# Altium schematic sheet MCU.SchDoc
size A2
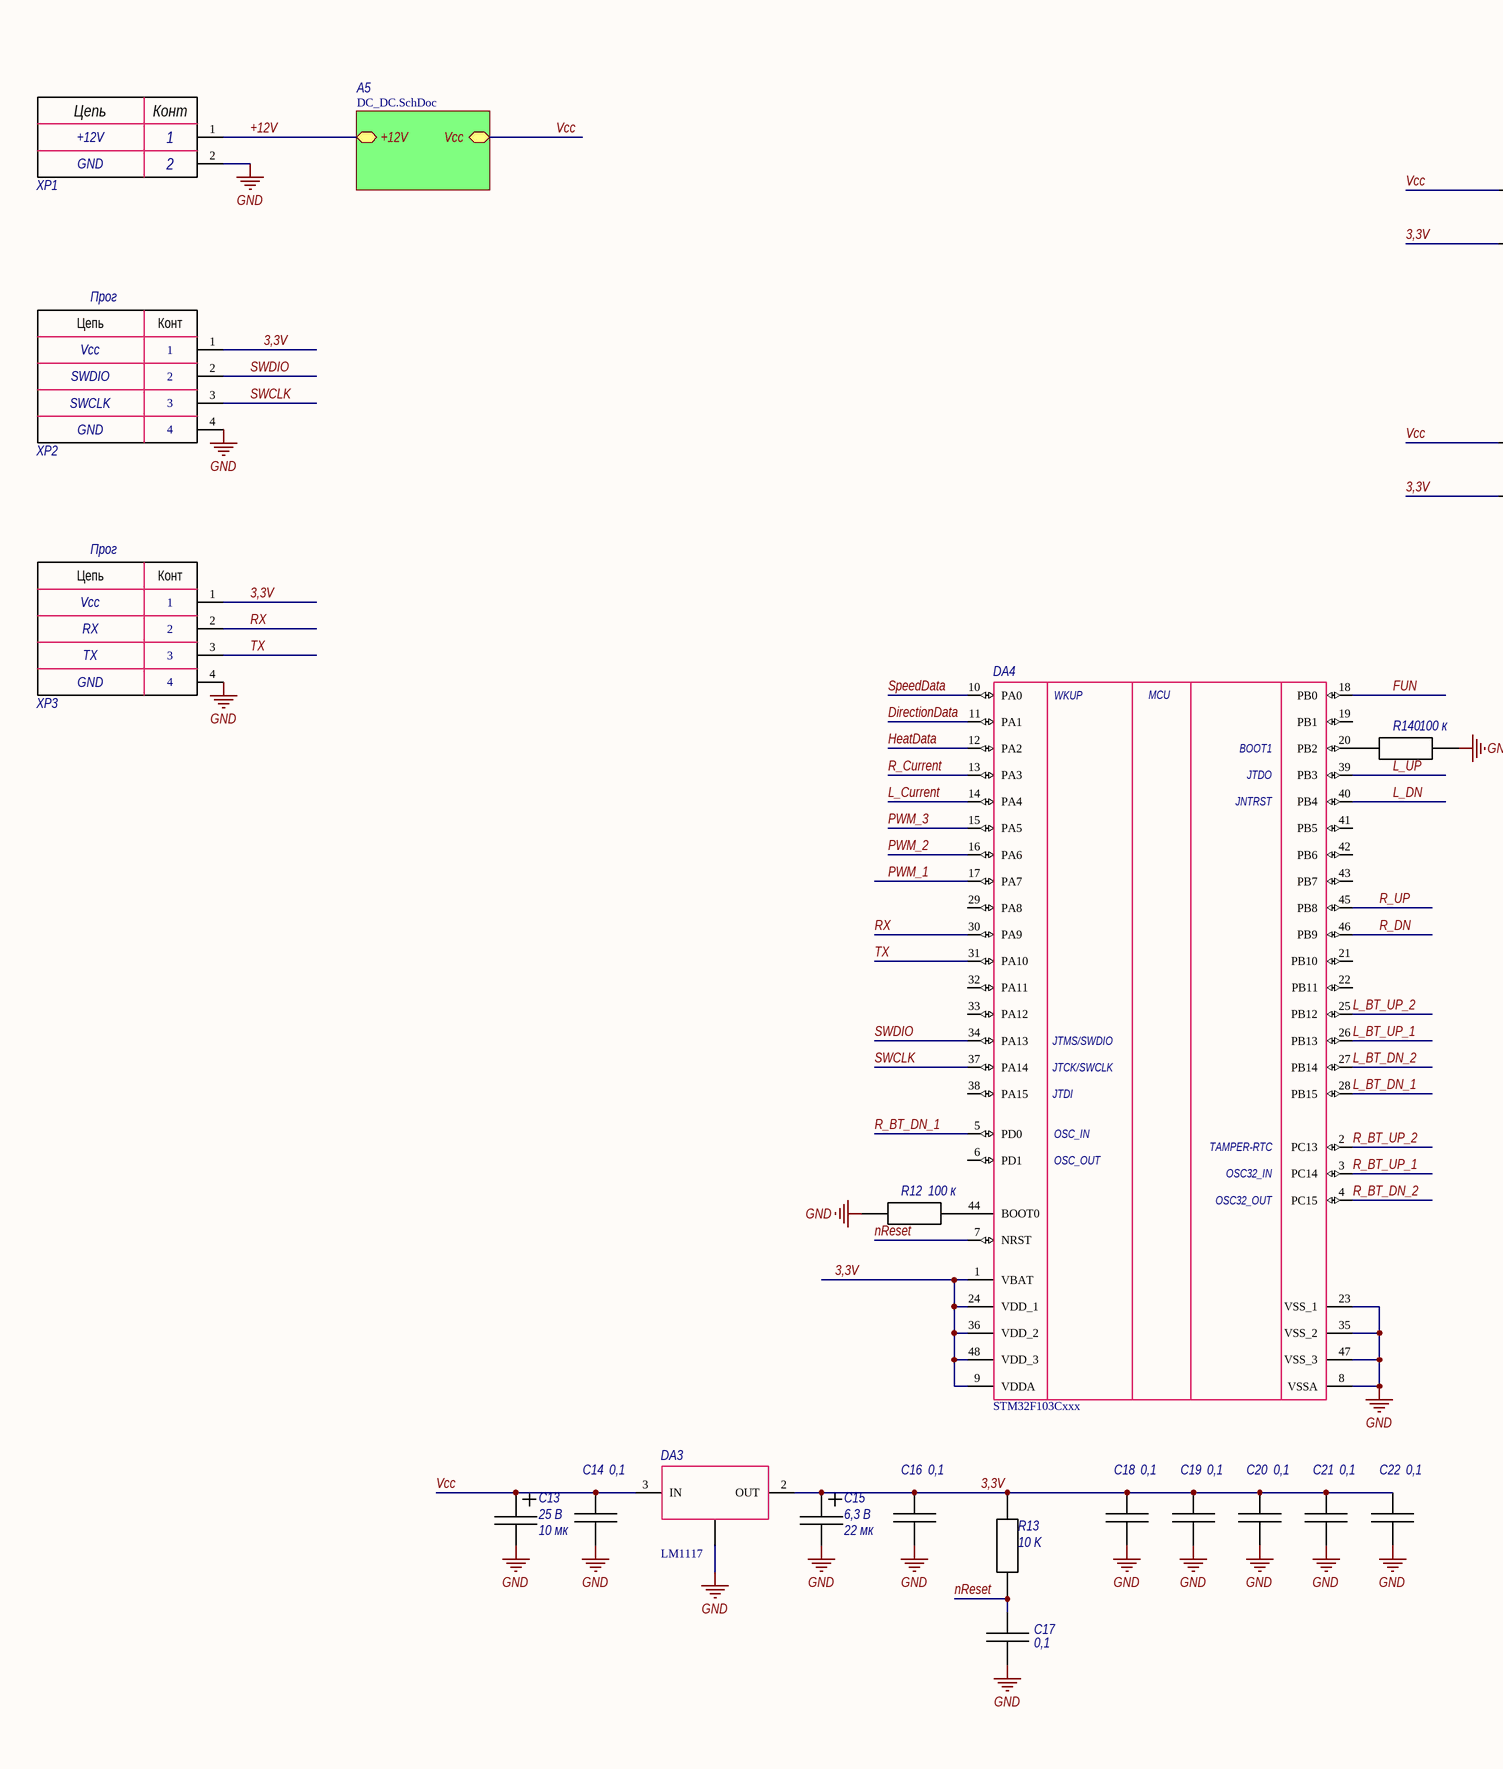
[diagram p0: MCU.SchDoc, left]
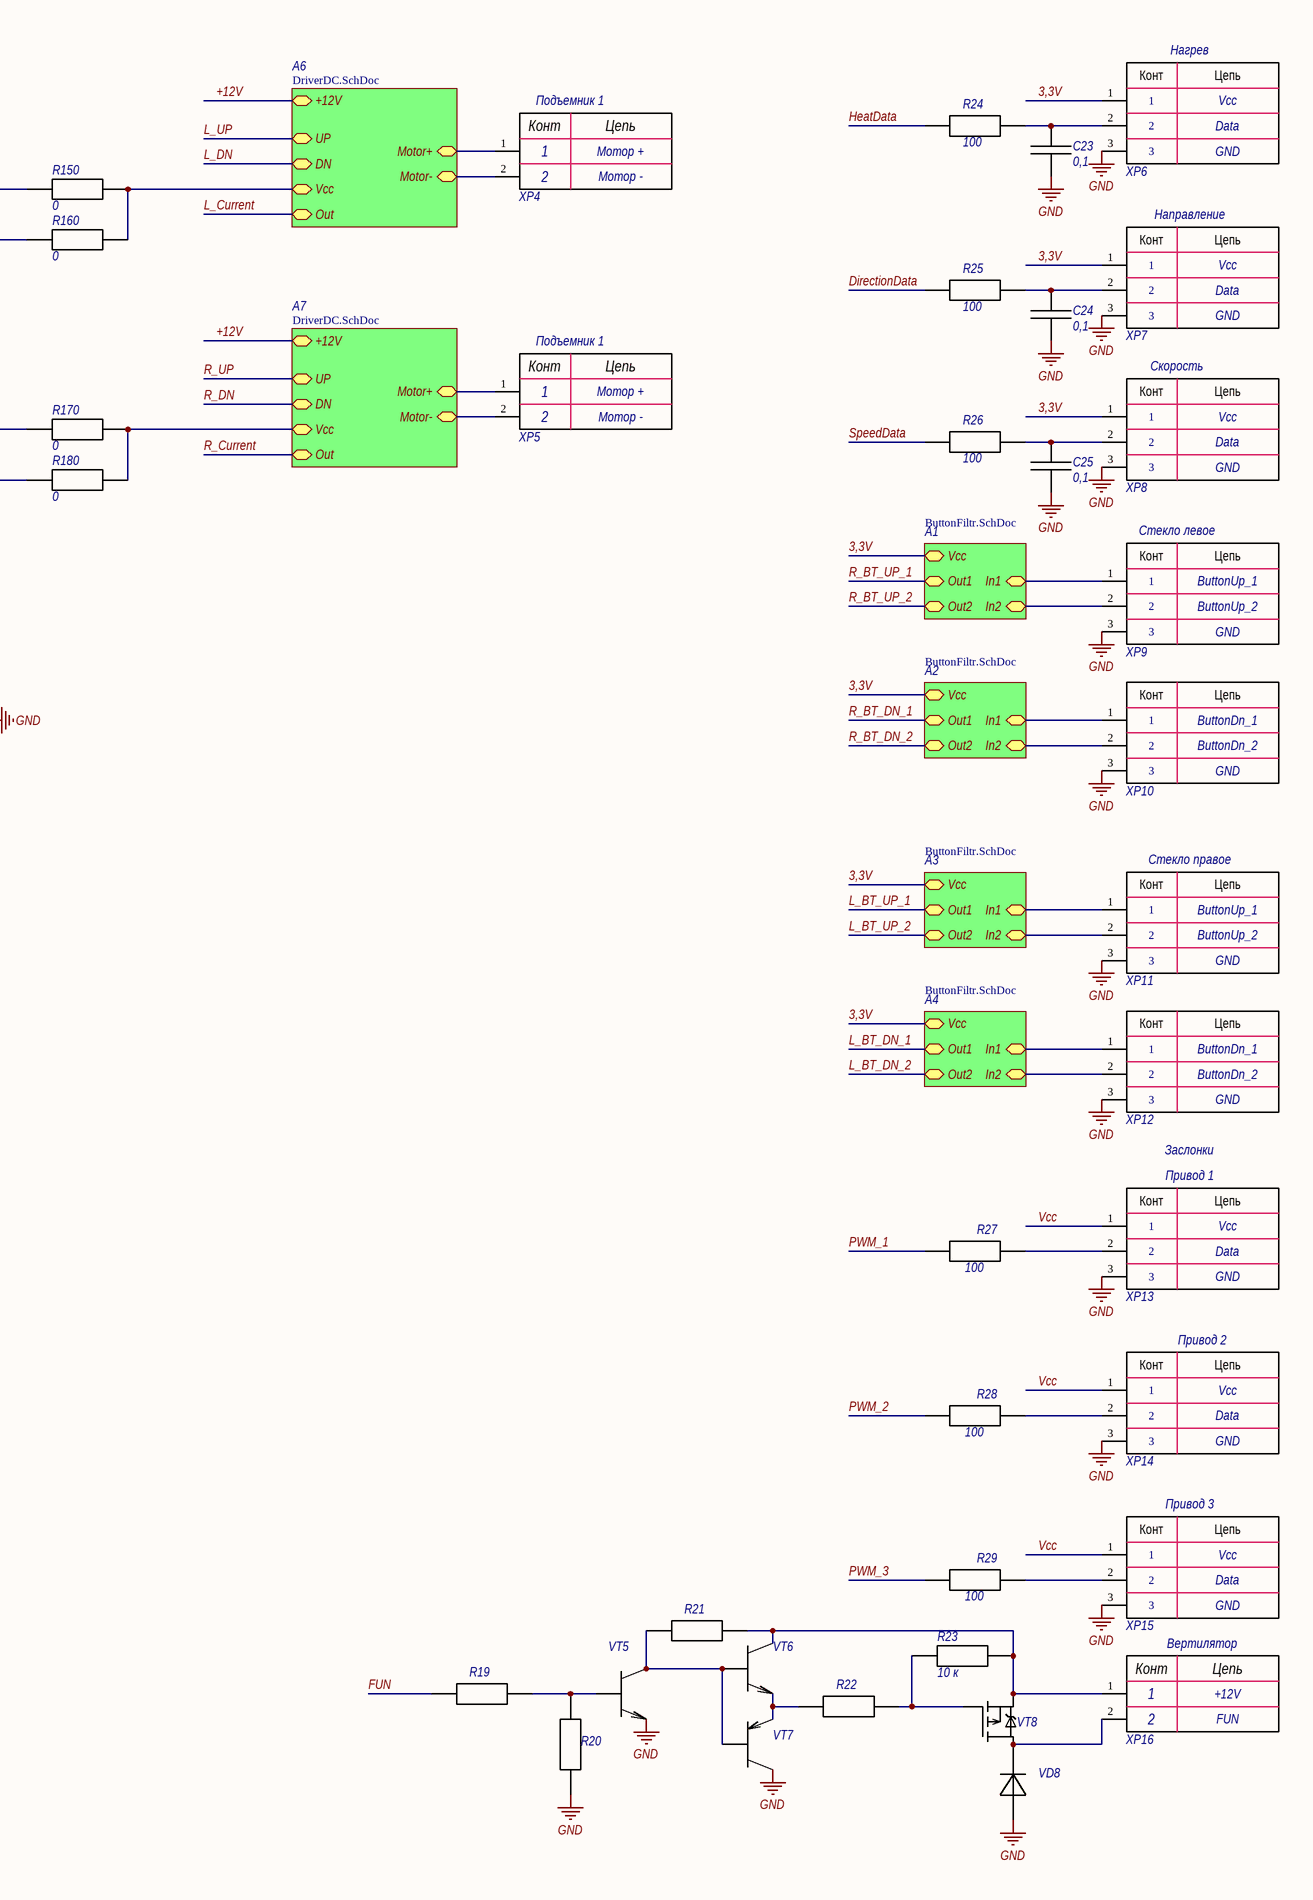
[diagram p1: MCU.SchDoc, right]

## Parts
C13  Power/Voltage: 25 В  Value Sch: 10 мк  [B-B]  (hidden comment: Конденсаторы танталовые)
C14  Value Sch: 0,1  [C0603_autoMount]  (hidden comment: Конденсаторы керамические)
C15  Power/Voltage: 6,3 В  Value Sch: 22 мк  [A-A]  (hidden comment: Конденсаторы танталовые)
C16  Value Sch: 0,1  [C0603_autoMount]  (hidden comment: Конденсаторы керамические)
C17  Value Sch: 0,1  [C0603_autoMount]  (hidden comment: Конденсаторы керамические)
C18  Value Sch: 0,1  [C0603_autoMount]  (hidden comment: Конденсаторы керамические)
C19  Value Sch: 0,1  [C0603_autoMount]  (hidden comment: Конденсаторы керамические)
C20  Value Sch: 0,1  [C0603_autoMount]  (hidden comment: Конденсаторы керамические)
C21  Value Sch: 0,1  [C0603_autoMount]  (hidden comment: Конденсаторы керамические)
C22  Value Sch: 0,1  [C0603_autoMount]  (hidden comment: Конденсаторы керамические)
C23  Value Sch: 0,1  [C0603_autoMount]  (hidden comment: Конденсаторы керамические)
C24  Value Sch: 0,1  [C0603_autoMount]  (hidden comment: Конденсаторы керамические)
C25  Value Sch: 0,1  [C0603_autoMount]  (hidden comment: Конденсаторы керамические)
DA3  LM1117  [SOT223]
DA4  STM32F103Cxxx  [TQFP_48]
R12  Value Sсh: 100 к  [R0603_autoMount]  (hidden comment: Resistor)
R13  Value Euro: 10 K  [R0603_autoMount]  (hidden comment: Resistor)
R19  Resistor  [R0603_autoMount]  (value not drawn)
R20  Resistor  [R0603_autoMount]  (value not drawn)
R21  Resistor  [R0603_autoMount]  (value not drawn)
R22  Resistor  [R0603_autoMount]  (value not drawn)
R23  Value Sсh: 10 к  [R0603_autoMount]  (hidden comment: Resistor)
R24  Value Sсh: 100  [R0603_autoMount]  (hidden comment: Resistor)
R25  Value Sсh: 100  [R0603_autoMount]  (hidden comment: Resistor)
R26  Value Sсh: 100  [R0603_autoMount]  (hidden comment: Resistor)
R27  Value Sсh: 100  [R0603_autoMount]  (hidden comment: Resistor)
R28  Value Sсh: 100  [R0603_autoMount]  (hidden comment: Resistor)
R29  Value Sсh: 100  [R0603_autoMount]  (hidden comment: Resistor)
R140  Value Sсh: 100 к  [R0603_autoMount]  (hidden comment: Resistor)
R150  Value Sсh: 0  [R0603_autoMount]  (hidden comment: Resistor)
R160  Value Sсh: 0  [R0603_autoMount]  (hidden comment: Resistor)
R170  Value Sсh: 0  [R0603_autoMount]  (hidden comment: Resistor)
R180  Value Sсh: 0  [R0603_autoMount]  (hidden comment: Resistor)
VD8  Diode  [DO-41_Vertical]  (value not drawn)
VT5  npn  [SOT23-3]  (value not drawn)
VT6  npn  [SOT23-3]  (value not drawn)
VT7  pnp  [SOT23-3]  (value not drawn)
VT8  P-Chanel Mosfet_dpak  [DPAK]  (value not drawn)
XP1  2pin  [301-021-12]  (value not drawn)
XP2  4pin  [PLS-4]  (value not drawn)
XP3  4pin  [PLS-4]  (value not drawn)
XP4  2pin  [301-021-12]  (value not drawn)
XP5  2pin  [301-021-12]  (value not drawn)
XP6  3pin  [CWF-3]  (value not drawn)
XP7  3pin  [CWF-3]  (value not drawn)
XP8  3pin  [CWF-3]  (value not drawn)
XP9  3pin  [CWF-3]  (value not drawn)
XP10  3pin  [CWF-3]  (value not drawn)
XP11  3pin  [CWF-3]  (value not drawn)
XP12  3pin  [CWF-3]  (value not drawn)
XP13  3pin  [CWF-3]  (value not drawn)
XP14  3pin  [CWF-3]  (value not drawn)
XP15  3pin  [CWF-3]  (value not drawn)
XP16  2pin  [301-021-12]  (value not drawn)

## Sub-sheets
A1 = ButtonFiltr.SchDoc: In2, Out2, Out1, In1, Vcc
A2 = ButtonFiltr.SchDoc: In2, Out2, Out1, In1, Vcc
A3 = ButtonFiltr.SchDoc: In2, Out2, Out1, In1, Vcc
A4 = ButtonFiltr.SchDoc: In2, Out2, Out1, In1, Vcc
A5 = DC_DC.SchDoc: Vcc, +12V
A6 = DriverDC.SchDoc: +12V, UP, DN, Motor+, Motor-, Vcc, Out
A7 = DriverDC.SchDoc: +12V, UP, DN, Motor+, Motor-, Vcc, Out

## Nets
GND: C13.2 C14.1 C15.2 C16.1 C17.1 C18.1 C19.1 C20.1 C21.1 C22.1 C23.1 C24.1 C25.1 DA3.1(GND) DA4.8(VSSA) DA4.23(VSS_1) DA4.35(VSS_2) DA4.47(VSS_3) R12.2 R20.2 R140.1 VD8.2 VT5.2(E) VT7.3(C) XP1.2 XP2.4 XP3.4 XP6.3 XP7.3 XP8.3 XP9.3 XP10.3 XP11.3 XP12.3 XP13.3 XP14.3 XP15.3
3,3V: C15.1 C16.2 C18.2 C19.2 C20.2 C21.2 C22.2 DA3.2(OUT) DA4.1(VBAT) DA4.9(VDDA) DA4.24(VDD_1) DA4.36(VDD_2) DA4.48(VDD_3) R13.1 R160.2 R180.2 XP2.1 XP3.1 XP6.1 XP7.1 XP8.1 ; sheet A1/Vcc, sheet A2/Vcc, sheet A3/Vcc, sheet A4/Vcc
+12V: XP1.1 ; sheet A5/+12V, sheet A6/+12V, sheet A7/+12V
DirectionData: DA4.11(PA1) R25.2
FUN: DA4.18(PB0) R19.2
HeatData: DA4.12(PA2) R24.2
L_BT_DN_1: DA4.28(PB15) ; sheet A4/Out1
L_BT_DN_2: DA4.27(PB14) ; sheet A4/Out2
L_BT_UP_1: DA4.26(PB13) ; sheet A3/Out1
L_BT_UP_2: DA4.25(PB12) ; sheet A3/Out2
L_Current: DA4.14(PA4) ; sheet A6/Out
L_DN: DA4.40(PB4) ; sheet A6/DN
L_UP: DA4.39(PB3) ; sheet A6/UP
nReset: C17.2 DA4.7(NRST) R13.2
PWM_1: DA4.17(PA7) R27.2
PWM_2: DA4.16(PA6) R28.2
PWM_3: DA4.15(PA5) R29.2
R_BT_DN_1: DA4.5(PD0) ; sheet A2/Out1
R_BT_DN_2: DA4.4(PC15) ; sheet A2/Out2
R_BT_UP_1: DA4.3(PC14) ; sheet A1/Out1
R_BT_UP_2: DA4.2(PC13) ; sheet A1/Out2
R_Current: DA4.13(PA3) ; sheet A7/Out
R_DN: DA4.46(PB9) ; sheet A7/DN
R_UP: DA4.45(PB8) ; sheet A7/UP
RX: DA4.30(PA9) XP3.2
SpeedData: DA4.10(PA0) R26.2
SWCLK: DA4.37(PA14) XP2.3
SWDIO: DA4.34(PA13) XP2.2
TX: DA4.31(PA10) XP3.3
Vcc: C13.1 C14.2 DA3.3(IN) R150.2 R170.2 XP13.1 XP14.1 XP15.1 ; sheet A5/Vcc
NetC23_2: C23.2 R24.1 XP6.2
NetC24_2: C24.2 R25.1 XP7.2
NetC25_2: C25.2 R26.1 XP8.2
NetDA4_20: DA4.20(PB2) R140.2
NetDA4_44: DA4.44(BOOT0) R12.1
NetR19_1: R19.1 R20.1 VT5.1(B)
NetR21_1: R21.1 R23.2 VT6.3(C) VT8.3(S) XP16.1
NetR21_2: R21.2 VT5.3(C) VT6.1(B) VT7.1(B)
NetR22_1: R22.1 R23.1 VT8.1(G)
NetR22_2: R22.2 VT6.2(E) VT7.2(E)
NetR27_1: R27.1 XP13.2
NetR28_1: R28.1 XP14.2
NetR29_1: R29.1 XP15.2
NetR150_1: R150.1 R160.1 ; sheet A6/Vcc
NetR170_1: R170.1 R180.1 ; sheet A7/Vcc
NetVD8_1: VD8.1 VT8.2(D) XP16.2
NetXP4_1: XP4.1 ; sheet A6/Motor+
NetXP4_2: XP4.2 ; sheet A6/Motor-
NetXP5_1: XP5.1 ; sheet A7/Motor+
NetXP5_2: XP5.2 ; sheet A7/Motor-
NetXP9_1: XP9.1 ; sheet A1/In1
NetXP9_2: XP9.2 ; sheet A1/In2
NetXP10_1: XP10.1 ; sheet A2/In1
NetXP10_2: XP10.2 ; sheet A2/In2
NetXP11_1: XP11.1 ; sheet A3/In1
NetXP11_2: XP11.2 ; sheet A3/In2
NetXP12_1: XP12.1 ; sheet A4/In1
NetXP12_2: XP12.2 ; sheet A4/In2

Not connected (* = marked no-connect by the designer): DA4 6(PD1) 19(PB1) 21(PB10) 22(PB11) 29(PA8) 32(PA11) 33(PA12) 38(PA15) 41(PB5) 42(PB6) 43(PB7)

## Notes on the sheet
- Нагрев
- (near XP4) Подъемник 1
- Vcc
- +12V
- GND
- Мотор +
- Мотор -
- Data
- Направление
- Прог
- SWDIO
- (near XP5) Подъемник 1
- Скорость
- SWCLK
- Стекло левое
- RX
- ButtonUp_1
- ButtonUp_2
- TX
- ButtonDn_1
- ButtonDn_2
- (near XP11) Стекло правое
- Заслонки
- Привод 1
- Привод 2
- Привод 3
- Вертилятор
- FUN
- (in symbol Вилка  CWF-3 "Connfly electronic") Конт; Цепь
- (in symbol Вилка DS1021-1*4SF11-B PLS-4 "Connfly electronic") Цепь; Конт
- (in symbol Клеммник XY301VA-5.0-2P-12 "Ningbo Xinya M&E") Конт; Цепь
- (in symbol Микросхема CH32F103C8T6 "WinChip" TQFP-48) WKUP; MCU; BOOT1; JTDO; JNTRST; JTMS/SWDIO; JTCK/SWCLK; JTDI; OSC_IN; TAMPER-RTC; OSC_OUT; OSC32_IN; OSC32_OUT

## Library data of the parts
C13 = Конденсатор танталовый 10 мкФ 25 В "B" +/- 10% T491B106K025AT "KEMET": Part Number Euro: 10 uF 25 V "B" +/- 10% T491B106K025AT "KEMET"; Voltage Euro: 25 V; Tolerance: +/- 10%; Value: 10 мкФ; Value Euro: 10 uF; Part Number: Конденсатор танталовый 10 мкФ 25 В "B" +/- 10% T491B106K025AT "KEMET"; Manufacturer: "KEMET"; ManufacturerPartNumber: T491B106K025AT; Package: "B"; ComponentType: Конденсатор танталовый
C14 C16-C25 = Чип. керам. 0603 0,1 мкФ 50 В +/-10% X7R CC0603KKX7R9BB104 "Yageo": Part Number Euro: 100 nF 50  V +/-10% X7R CC0603KKX7R9BB104 "Yageo"; Power/Voltage: 50 В; Voltage Euro: 50  V; TKE: X7R; Tolerance: +/-10%; Value: 0,1 мкФ; Value Euro: 100 nF; Part Number: Чип. керам. 0603 0,1 мкФ 50 В +/-10% X7R CC0603KKX7R9BB104 "Yageo"; Manufacturer: "Yageo"; ManufacturerPartNumber: CC0603KKX7R9BB104; Package: Чип конд. 0603; Price: 9; ComponentType: Чип. керам. 0603
C15 = Конденсатор танталовый 22 мкФ 6,3 В "A" +/- 10% TAJA226K006 "Kyocera AVX": Part Number Euro: 22 uF 6,3 V "A" +/- 10% TAJA226K006 "Kyocera AVX"; Voltage Euro: 6,3 V; Tolerance: +/- 10%; Value: 22 мкФ; Value Euro: 22 uF; Part Number: Конденсатор танталовый 22 мкФ 6,3 В "A" +/- 10% TAJA226K006 "Kyocera AVX"; Manufacturer: "Kyocera AVX"; ManufacturerPartNumber: TAJA226K006; Package: "A"; ComponentType: Конденсатор танталовый
DA3 = Стабилизатор AMS1117-3.3 "Advanced Monolithic Systems" SOT-223: Part Number: Стабилизатор AMS1117-3.3 "Advanced Monolithic Systems" SOT-223; Part Number Euro: AMS1117-3.3 "Advanced Monolithic Systems" SOT-223; Manufacturer: "Advanced Monolithic Systems"; ManufacturerPartNumber: AMS1117-3.3; Package: SOT-223; ComponentType: Стабилизатор
DA4 = Микросхема CH32F103C8T6 "WinChip" TQFP-48: Part Number: Микросхема CH32F103C8T6 "WinChip" TQFP-48; Part Number Euro: CH32F103C8T6 "WinChip" TQFP-48; Manufacturer: "WinChip"; ManufacturerPartNumber: CH32F103C8T6; Package: TQFP-48; ComponentType: Микросхема
R12 R140 = Чип рез. 0603 100 кОм  +/-1% RC0603FR-07100KL "Yageo": Part Number Euro: RC0603FR-07100KL 100 K +/-1% "Yageo"; Tolerance: +/-1%; Value: 100 кОм; Value Euro: 100 K; Part Number: Чип рез. 0603 100 кОм  +/-1% RC0603FR-07100KL "Yageo"; Manufacturer: "Yageo"; ManufacturerPartNumber: RC0603FR-07100KL; Package: Чип рез. 0603; ComponentType: Чип рез. 0603
R13 = Чип рез. 0603 10 кОм  +/-1% RC0603FR-0710KL "Yageo": Part Number Euro: RC0603FR-0710KL 10 K +/-1% "Yageo"; Tolerance: +/-1%; Value: 10 кОм; Value Sсh: 10 к; Part Number: Чип рез. 0603 10 кОм  +/-1% RC0603FR-0710KL "Yageo"; Manufacturer: "Yageo"; ManufacturerPartNumber: RC0603FR-0710KL; Package: Чип рез. 0603; ComponentType: Чип рез. 0603
R19 R21 = Чип рез. 0603 1 кОм  +/-1% RC0603FR-071KL "Yageo": Part Number Euro: RC0603FR-071KL 1 K +/-1% "Yageo"; Tolerance: +/-1%; Value: 1 кОм; Value Sсh: 1 к; Value Euro: 1 K; Part Number: Чип рез. 0603 1 кОм  +/-1% RC0603FR-071KL "Yageo"; Manufacturer: "Yageo"; ManufacturerPartNumber: RC0603FR-071KL; Package: Чип рез. 0603; ComponentType: Чип рез. 0603
R20 = Чип рез. 0603 10 кОм  +/-1% RC0603FR-0710KL "Yageo": Part Number Euro: RC0603FR-0710KL 10 K +/-1% "Yageo"; Tolerance: +/-1%; Value: 10 кОм; Value Sсh: 10 к; Value Euro: 10 K; Part Number: Чип рез. 0603 10 кОм  +/-1% RC0603FR-0710KL "Yageo"; Manufacturer: "Yageo"; ManufacturerPartNumber: RC0603FR-0710KL; Package: Чип рез. 0603; ComponentType: Чип рез. 0603
R22 = Чип рез. 0603 10 Ом  +/-1% RC0603FR-0710RL "Yageo": Part Number Euro: RC0603FR-0710RL 10 R +/-1% "Yageo"; Tolerance: +/-1%; Value: 10 Ом; Value Sсh: 10; Value Euro: 10 R; Part Number: Чип рез. 0603 10 Ом  +/-1% RC0603FR-0710RL "Yageo"; Manufacturer: "Yageo"; ManufacturerPartNumber: RC0603FR-0710RL; Package: Чип рез. 0603; ComponentType: Чип рез. 0603
R23 = Чип рез. 0603 10 кОм  +/-1% RC0603FR-0710KL "Yageo": Part Number Euro: RC0603FR-0710KL 10 K +/-1% "Yageo"; Part Number GOST: Чип рез. 0603 10 кОм  +/-1% 0,1 Вт; Tolerance: +/-1%; Value: 10 кОм; Value Euro: 10 K; Power/Voltage: 0,1 Вт; Part Number: Чип рез. 0603 10 кОм  +/-1% RC0603FR-0710KL "Yageo"; Manufacturer: "Yageo"; ManufacturerPartNumber: RC0603FR-0710KL; Package: Чип рез. 0603; ComponentType: Чип рез. 0603
R24-R29 = Чип рез. 0603 100 Ом  +/-1% RC0603FR-07100RL "Yageo": Part Number Euro: RC0603FR-07100RL 100 R +/-1% "Yageo"; Tolerance: +/-1%; Value: 100 Ом; Value Euro: 100 R; Part Number: Чип рез. 0603 100 Ом  +/-1% RC0603FR-07100RL "Yageo"; Manufacturer: "Yageo"; ManufacturerPartNumber: RC0603FR-07100RL; Package: Чип рез. 0603; ComponentType: Чип рез. 0603
R150 R160 R170 R180 = Чип рез. 0603 0 Ом  +/-1% RC0603FR-070RL "Yageo": Part Number Euro: RC0603FR-070RL 0 R +/-1% "Yageo"; Part Number GOST: Чип рез. 0603 0 Ом  +/-1% 0,1 Вт; Tolerance: +/-1%; Value: 0 Ом; Value Euro: 0 R; Power/Voltage: 0,1 Вт; Part Number: Чип рез. 0603 0 Ом  +/-1% RC0603FR-070RL "Yageo"; Manufacturer: "Yageo"; ManufacturerPartNumber: RC0603FR-070RL; Package: Чип рез. 0603; ComponentType: Чип рез. 0603
VD8 = Диод 1N4007  DO-41: ManufacturerPartNumber: 1N4007; Part Number: Диод 1N4007  DO-41; Part Number Euro: 1N4007  DO-41; Package: DO-41; ComponentType: Диод
VT5 VT6 = Транзистор BC847B SOT23-3: ManufacturerPartNumber: BC847B; Value: BC847B; Примечание: 1F; Package: SOT23-3; Part Number: Транзистор BC847B SOT23-3; Part Number Euro: BC847B SOT23-3; ComponentType: Транзистор
VT7 = Транзистор BC857B SOT23-3: ManufacturerPartNumber: BC857B; Value: BC857B; Package: SOT23-3; Part Number: Транзистор BC857B SOT23-3; Part Number Euro: BC857B SOT23-3; ComponentType: Транзистор
VT8 = Транзистор NTD2955T4G D-PAK "ON Semiconductor": Part Number: Транзистор NTD2955T4G D-PAK "ON Semiconductor"; Part Number Euro: NTD2955T4G D-PAK "ON Semiconductor"; Manufacturer: "ON Semiconductor"; ManufacturerPartNumber: NTD2955T4G; Package: D-PAK; Value: NTD2955T4G; ComponentType: Транзистор
XP1 XP4 XP5 XP16 = Клеммник XY301VA-5.0-2P-12 "Ningbo Xinya M&E": Примечание: Аналог 301-021-12; Rem: *; Value: *; Tolerance: *; Power/Voltage: *; TKE: *; ManufacturerPartNumber: XY301VA-5.0-2P-12; Manufacturer: "Ningbo Xinya M&E"; Quantity: *; Part Number: Клеммник XY301VA-5.0-2P-12 "Ningbo Xinya M&E"; Part Number Euro: XY301VA-5.0-2P-12 "Ningbo Xinya M&E"; ComponentType: Клеммник
XP2 XP3 = Вилка DS1021-1*4SF11-B PLS-4 "Connfly electronic": Rem: *; Value: *; Tolerance: *; Power/Voltage: *; TKE: *; ManufacturerPartNumber: DS1021-1*4SF11-B; Manufacturer: "Connfly electronic"; Quantity: *; Примечание: *; Package: PLS-4; Part Number: Вилка DS1021-1*4SF11-B PLS-4 "Connfly electronic"; Part Number Euro: DS1021-1*4SF11-B PLS-4 "Connfly electronic"; ComponentType: Вилка
XP6-XP15 = Вилка  CWF-3 "Connfly electronic": Rem: *; Value: *; Tolerance: *; Power/Voltage: *; TKE: *; ManufacturerPartNumber: *; Manufacturer: "Connfly electronic"; Quantity: *; Примечание: *; Package: CWF-3; Part Number: Вилка  CWF-3 "Connfly electronic"; ComponentType: Вилка